# Altium schematic sheet Signals2uC.SchDoc
size A4
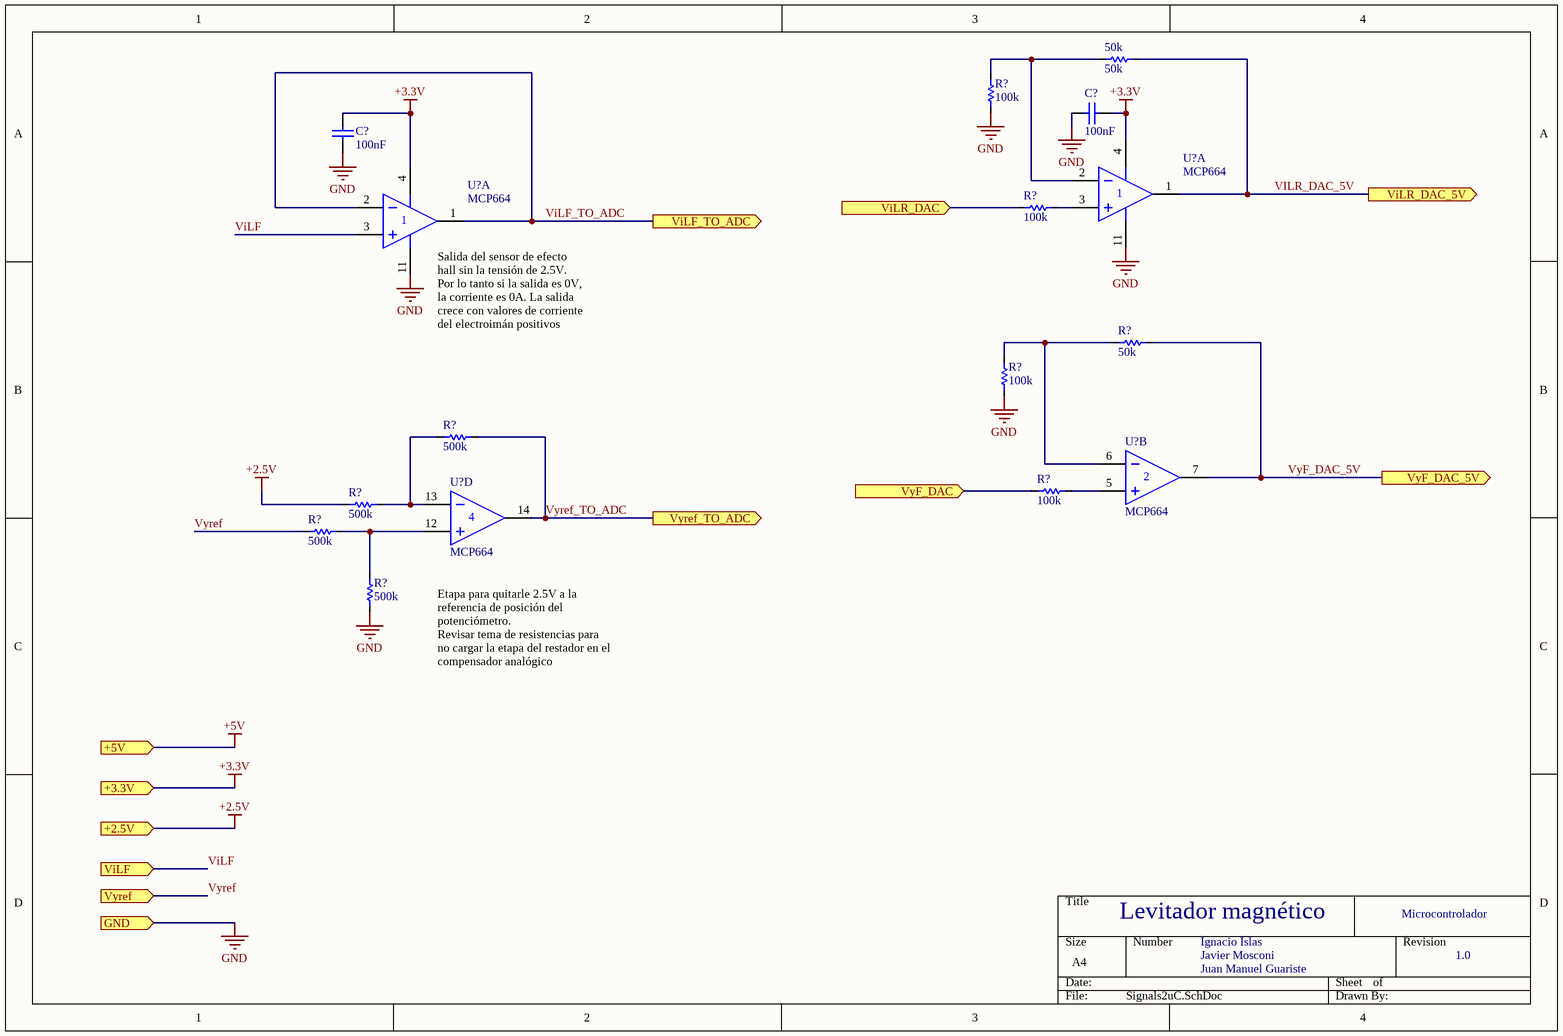
[diagram p0: Signals2uC.SchDoc]

## Parts
(Parts that share a designator on the sheet are numbered #1, #2 ... from top to bottom, then left to right.)
50k  value 50k  [R 1206L]  (hidden comment: Resistencia)
C?#1  value 100nF  [R2012-0805]  (hidden comment: Capacitor)
C?#2  value 100nF  [R2012-0805]  (hidden comment: Capacitor)
R?#1  value 100k  [R 1206L]  (hidden comment: Resistencia)
R?#2  value 100k  [R 1206L]  (hidden comment: Resistencia)
R?#3  value 50k  [R 1206L]  (hidden comment: Resistencia)
R?#4  value 100k  [R 1206L]  (hidden comment: Resistencia)
R?#5  value 500k  [R 1206L]  (hidden comment: Resistencia)
R?#6  value 100k  [R 1206L]  (hidden comment: Resistencia)
R?#7  value 500k  [R 1206L]  (hidden comment: Resistencia)
R?#8  value 500k  [R 1206L]  (hidden comment: Resistencia)
R?#9  value 500k  [R 1206L]  (hidden comment: Resistencia)
U?#1  MCP664  [SOIC14]  (part A of 4)
U?#2  MCP664  [SOIC14]  (part A of 4)
U?#3  MCP664  [SOIC14]  (part B of 4)
U?#4  MCP664  [SOIC14]  (part D of 4)

## Ports
+2.5V (in), +3.3V (in), +5V (in), GND (in), ViLF (in), ViLF_TO_ADC (out), ViLR_DAC (in), ViLR_DAC_5V (out), VyF_DAC (in), VyF_DAC_5V (out), Vyref (in), Vyref_TO_ADC (out)

## Nets
+2.5V: R?#7.2 ; port +2.5V
+3.3V: C?#1.2 C?#2.1 U?#1.4(V+) U?#2.4(V+) ; port +3.3V
+5V: port +5V
GND: C?#1.1 C?#2.2 R?#1.1 R?#4.1 R?#9.1 U?#1.11(V-) U?#2.11(V-) ; port GND
ViLF: U?#2.3(IN+) ; port ViLF
ViLF_TO_ADC: U?#2.1(OUT) U?#2.2(IN-) ; port ViLF_TO_ADC
ViLR_DAC: R?#2.1 ; port ViLR_DAC
VILR_DAC_5V: 50k.2 U?#1.1(OUT) ; port ViLR_DAC_5V
VyF_DAC: R?#6.1 ; port VyF_DAC
VyF_DAC_5V: R?#3.2 U?#3.7(OUT) ; port VyF_DAC_5V
Vyref: R?#8.2 ; port Vyref
Vyref_TO_ADC: R?#5.2 U?#4.14(OUT) ; port Vyref_TO_ADC
Net50k_1: 50k.1 R?#1.2 U?#1.2(IN-)
NetR?#2_2: R?#2.2 U?#1.3(IN+)
NetR?#3_1: R?#3.1 R?#4.2 U?#3.6(IN-)
NetR?#5_1: R?#5.1 R?#7.1 U?#4.13(IN-)
NetR?#6_2: R?#6.2 U?#3.5(IN+)
NetR?#8_1: R?#8.1 R?#9.2 U?#4.12(IN+)

## Notes on the sheet
- (near U?#2) Salida del sensor de efecto hall sin la tensión de 2.5V.
  Por lo tanto si la salida es 0V, la corriente es 0A. La salida crece con valores de corriente del electroimán positivos
- Etapa para quitarle 2.5V a la referencia de posición del potenciómetro.
  Revisar tema de resistencias para no cargar la etapa del restador en el compensador analógico
- Levitador magnético
- Microcontrolador
- Ignacio Islas
- Javier Mosconi
- Juan Manuel Guariste
- 1.0

## Library data of the parts
50k R?#1-R?#9 = Resistencia: Manufacturer: Generic Components; Class I: Passive; Class II: Resistor; Published: 8-Jun-2000; Revision: July-2002: Re-released for DXP Platform.; Publisher: Altium Limited
C?#1 C?#2 = Capacitor: Manufacturer: Generic Components; Class: Passive; Published: 08/06/2000; Publisher: Altium Hobart Technology Centre; SubClass: Capacitor
U?#1-U?#4 = MCP664: Datasheet: https://ar.mouser.com/datasheet/2/268/22194B-77503.pdf